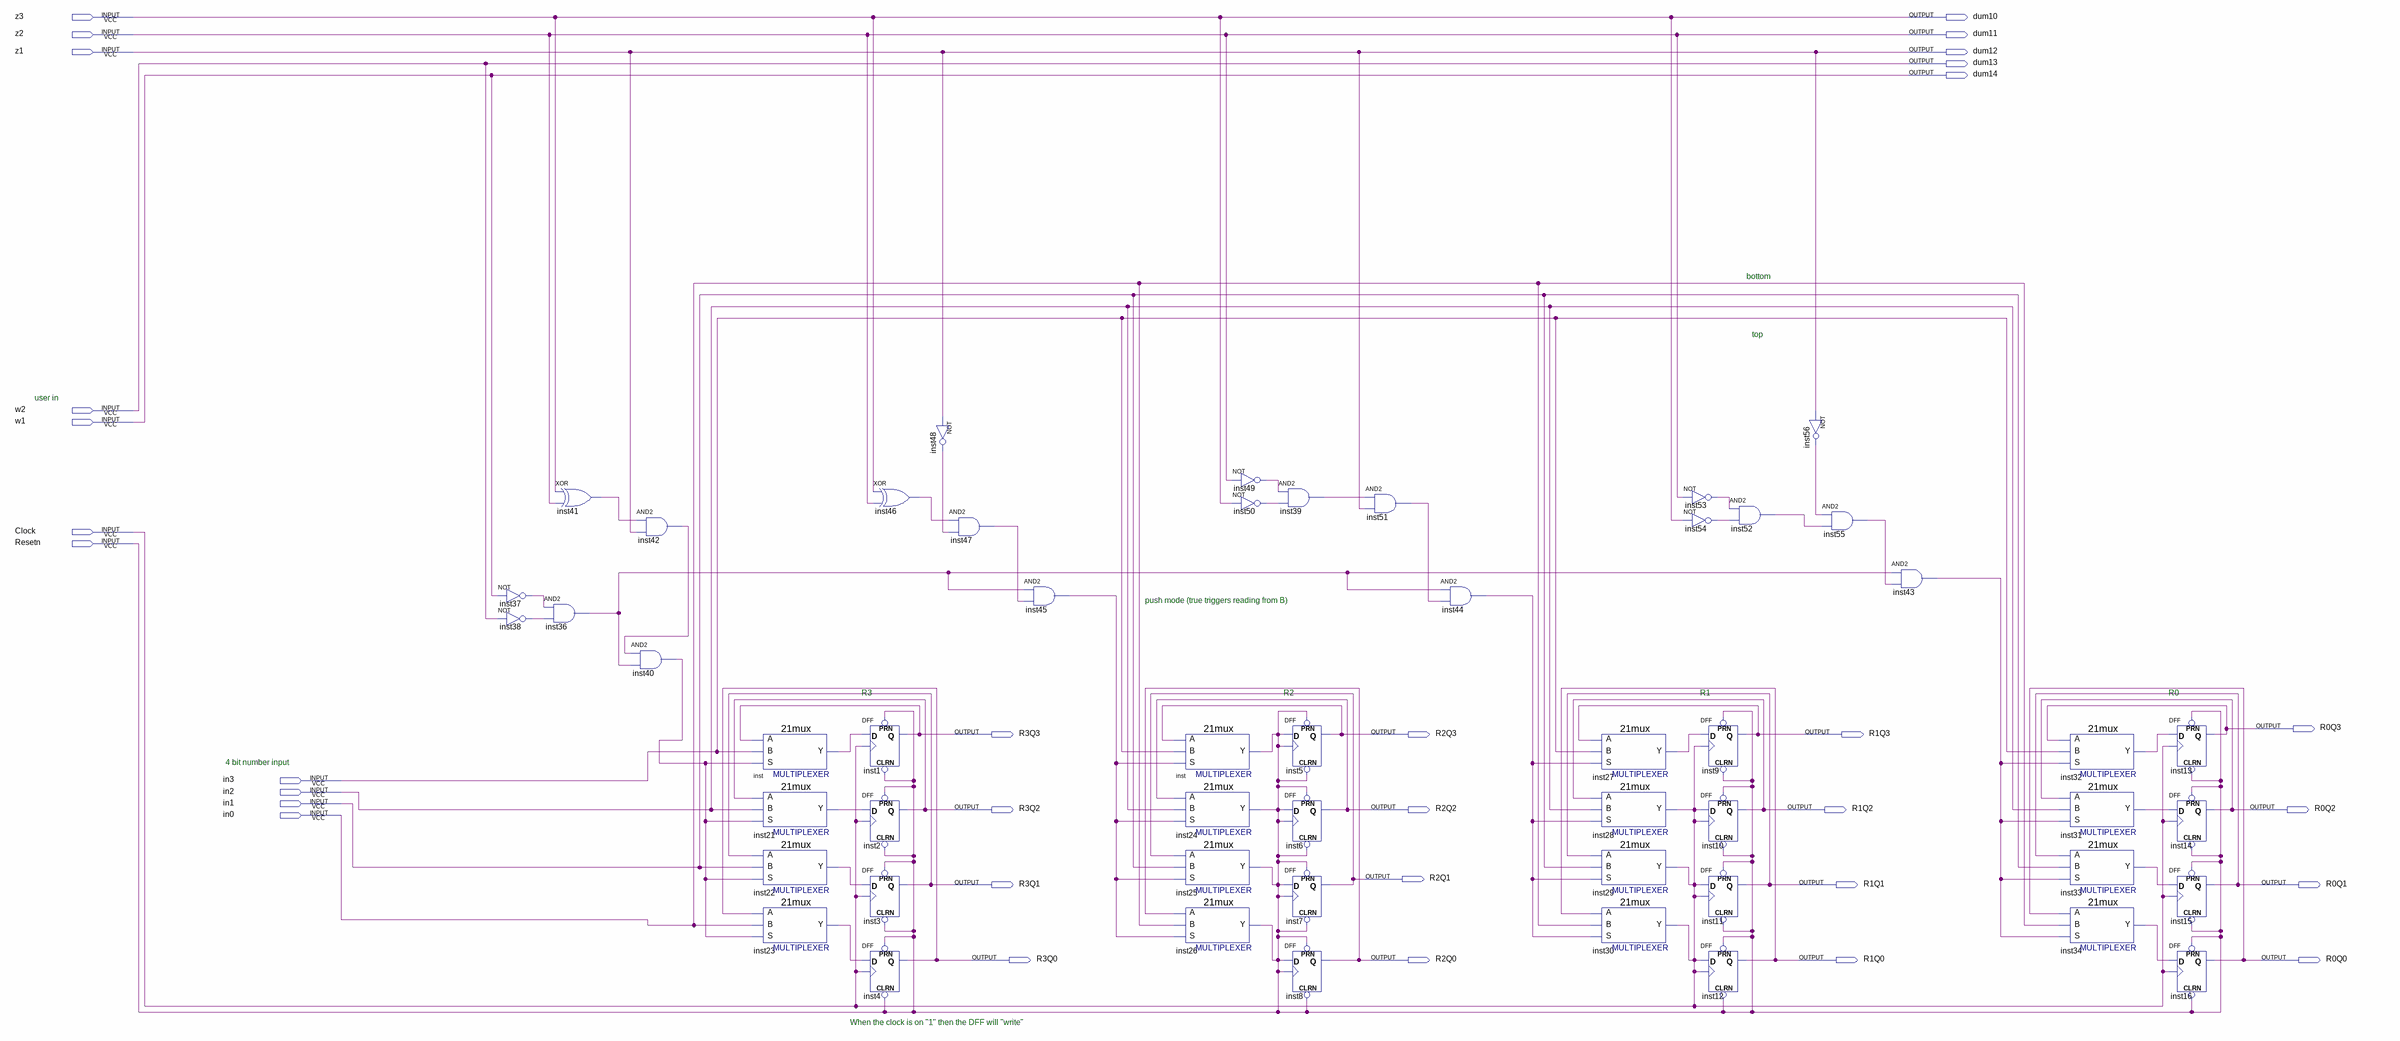
[diagram p0: schematic sheet]
// Quartus schematic stack.bdf as structural Verilog: 53 symbols, 32 pins
module stack (
  input  z3,
  input  z2,
  input  z1,
  input  w2,
  input  w1,
  input  Clock,
  input  Resetn,
  input  in3,
  input  in2,
  input  in1,
  input  in0,
  output dum10,
  output dum11,
  output dum12,
  output dum13,
  output dum14,
  output R0Q3,
  output R3Q3,
  output R2Q3,
  output R1Q3,
  output R3Q2,
  output R2Q2,
  output R1Q2,
  output R0Q2,
  output R2Q1,
  output R3Q1,
  output R1Q1,
  output R0Q1,
  output R3Q0,
  output R2Q0,
  output R1Q0,
  output R0Q0
);

  wire inst21_y, inst22_y, inst23_y, inst27_y, inst31_y, inst32_y, inst33_y, inst34_y, inst36_out,
       inst37_out, inst38_out, inst39_out, inst40_out, inst41_out, inst42_out, inst43_out, inst44_out,
       inst45_out, inst46_out, inst47_out, inst48_out, inst49_out, inst50_out, inst51_out, inst52_out,
       inst53_out, inst54_out, inst55_out, inst56_out, inst_y;

  not inst37 (inst37_out, w1);
  not inst38 (inst38_out, w2);
  xor inst41 (inst41_out, z3, z2);
  and inst36 (inst36_out, inst37_out, inst38_out);
  and inst42 (inst42_out, inst41_out, z1);
  and inst40 (inst40_out, inst42_out, inst36_out);
  \21mux  inst (.S(inst40_out), .B(in3), .A(R3Q3), .Y(inst_y));
  \21mux  inst21 (.S(inst40_out), .B(in2), .A(R3Q2), .Y(inst21_y));
  \21mux  inst22 (.S(inst40_out), .B(in1), .A(R3Q1), .Y(inst22_y));
  \21mux  inst23 (.S(inst40_out), .B(in0), .A(R3Q0), .Y(inst23_y));
  xor inst46 (inst46_out, z3, z2);
  DFF inst1 (.CLRN(Resetn), .CLK(Clock), .D(inst_y), .PRN(Resetn), .Q(R3Q3));
  DFF inst2 (.CLRN(Resetn), .CLK(Clock), .D(inst21_y), .PRN(Resetn), .Q(R3Q2));
  DFF inst3 (.CLRN(Resetn), .CLK(Clock), .D(inst22_y), .PRN(Resetn), .Q(R3Q1));
  DFF inst4 (.CLRN(Resetn), .CLK(Clock), .D(inst23_y), .PRN(Resetn), .Q(R3Q0));
  not inst48 (inst48_out, z1);
  and inst47 (inst47_out, inst46_out, inst48_out);
  and inst45 (inst45_out, inst36_out, inst47_out);
  \21mux  inst_dup2 (.S(inst45_out), .B(in3), .A(R2Q3), .Y(Resetn));
  \21mux  inst24 (.S(inst45_out), .B(in2), .A(R2Q2), .Y(Resetn));
  \21mux  inst25 (.S(inst45_out), .B(in1), .A(R2Q1), .Y(Resetn));
  \21mux  inst26 (.S(inst45_out), .B(in0), .A(R2Q0), .Y(Resetn));
  not inst49 (inst49_out, z2);
  not inst50 (inst50_out, z3);
  and inst39 (inst39_out, inst49_out, inst50_out);
  DFF inst5 (.CLRN(Resetn), .CLK(Resetn), .D(Resetn), .PRN(Resetn), .Q(R2Q3));
  DFF inst6 (.CLRN(Resetn), .CLK(Resetn), .D(Resetn), .PRN(Resetn), .Q(R2Q2));
  DFF inst7 (.CLRN(Resetn), .CLK(Resetn), .D(Resetn), .PRN(Resetn), .Q(R2Q1));
  DFF inst8 (.CLRN(Resetn), .CLK(Resetn), .D(Resetn), .PRN(Resetn), .Q(R2Q0));
  and inst51 (inst51_out, inst39_out, z1);
  and inst44 (inst44_out, inst36_out, inst51_out);
  \21mux  inst27 (.S(inst44_out), .B(in3), .A(R1Q3), .Y(inst27_y));
  \21mux  inst28 (.S(inst44_out), .B(in2), .A(R1Q2), .Y(Clock));
  \21mux  inst29 (.S(inst44_out), .B(in1), .A(R1Q1), .Y(Clock));
  \21mux  inst30 (.S(inst44_out), .B(in0), .A(R1Q0), .Y(Clock));
  not inst53 (inst53_out, z2);
  not inst54 (inst54_out, z3);
  and inst52 (inst52_out, inst53_out, inst54_out);
  DFF inst9 (.CLRN(Resetn), .CLK(Clock), .D(inst27_y), .PRN(Resetn), .Q(R1Q3));
  DFF inst10 (.CLRN(Resetn), .CLK(Clock), .D(Clock), .PRN(Resetn), .Q(R1Q2));
  DFF inst11 (.CLRN(Resetn), .CLK(Clock), .D(Clock), .PRN(Resetn), .Q(R1Q1));
  DFF inst12 (.CLRN(Resetn), .CLK(Clock), .D(Clock), .PRN(Resetn), .Q(R1Q0));
  not inst56 (inst56_out, z1);
  and inst55 (inst55_out, inst56_out, inst52_out);
  and inst43 (inst43_out, inst36_out, inst55_out);
  \21mux  inst32 (.S(inst43_out), .B(in3), .A(R0Q3), .Y(inst32_y));
  \21mux  inst31 (.S(inst43_out), .B(in2), .A(R0Q2), .Y(inst31_y));
  \21mux  inst33 (.S(inst43_out), .B(in1), .A(R0Q1), .Y(inst33_y));
  \21mux  inst34 (.S(inst43_out), .B(in0), .A(R0Q0), .Y(inst34_y));
  DFF inst13 (.CLRN(Resetn), .CLK(Clock), .D(inst32_y), .PRN(Resetn), .Q(R0Q3));
  DFF inst14 (.CLRN(Resetn), .CLK(Clock), .D(inst31_y), .PRN(Resetn), .Q(R0Q2));
  DFF inst15 (.CLRN(Resetn), .CLK(Clock), .D(inst33_y), .PRN(Resetn), .Q(R0Q1));
  DFF inst16 (.CLRN(Resetn), .CLK(Clock), .D(inst34_y), .PRN(Resetn), .Q(R0Q0));

  assign dum10 = z3;
  assign dum11 = z2;
  assign dum12 = z1;
  assign dum13 = w2;
  assign dum14 = w1;

  // Notes on the sheet:
  //   bottom
  //   top
  //   user in
  //   push mode (true triggers reading from B)
  //   R3
  //   R2
  //   R1
  //   R0
  //   4 bit number input
  //   When the clock is on "1" then the DFF will "write"
endmodule
